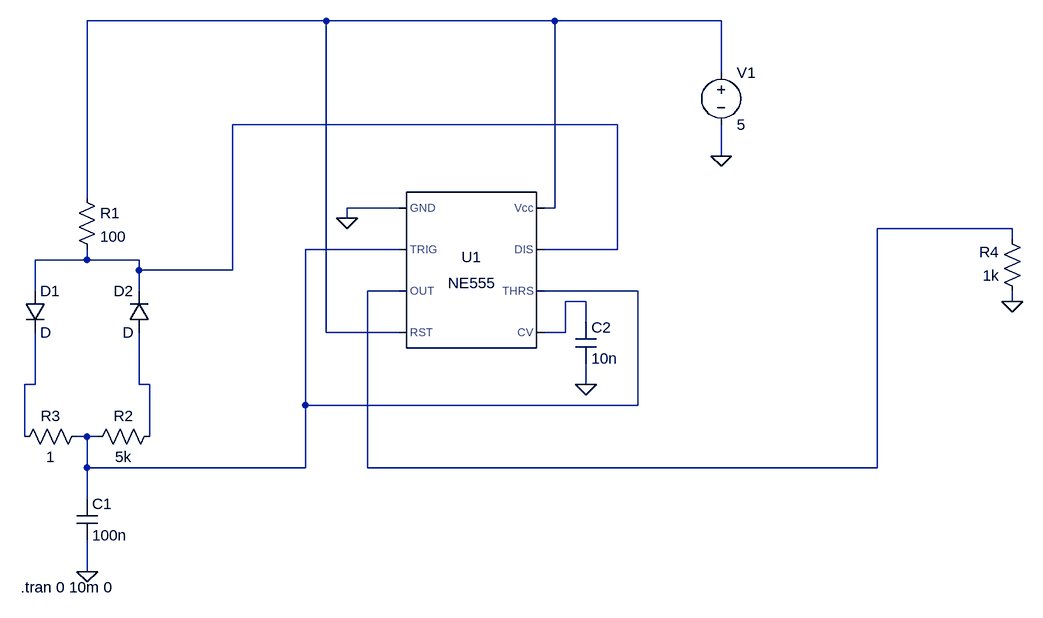
[diagram p0: schematic 555_osc.asc]
555_osc.asc, the LTspice schematic file:
Version 4
SHEET 1 1764 680
WIRE 688 -400 320 -400
WIRE 1040 -400 688 -400
WIRE 1296 -400 1040 -400
WIRE 1296 -320 1296 -400
WIRE 1136 -240 544 -240
WIRE 1296 -192 1296 -240
WIRE 320 -128 320 -400
WIRE 800 -112 720 -112
WIRE 1040 -112 1040 -400
WIRE 1040 -112 1024 -112
WIRE 720 -96 720 -112
WIRE 1744 -80 1536 -80
WIRE 1744 -64 1744 -80
WIRE 800 -48 656 -48
WIRE 1136 -48 1136 -240
WIRE 1136 -48 1024 -48
WIRE 320 -32 320 -48
WIRE 320 -32 240 -32
WIRE 400 -32 320 -32
WIRE 400 -16 400 -32
WIRE 544 -16 544 -240
WIRE 544 -16 400 -16
WIRE 240 16 240 -32
WIRE 400 16 400 -16
WIRE 800 16 752 16
WIRE 1168 16 1024 16
WIRE 1088 32 1056 32
WIRE 1744 32 1744 16
WIRE 1088 64 1088 32
WIRE 688 80 688 -400
WIRE 800 80 688 80
WIRE 1056 80 1056 32
WIRE 1056 80 1024 80
WIRE 240 160 240 80
WIRE 240 160 224 160
WIRE 400 160 400 80
WIRE 416 160 400 160
WIRE 1088 160 1088 128
WIRE 656 192 656 -48
WIRE 1168 192 1168 16
WIRE 1168 192 656 192
WIRE 224 240 224 160
WIRE 320 240 304 240
WIRE 336 240 320 240
WIRE 416 240 416 160
WIRE 320 288 320 240
WIRE 656 288 656 192
WIRE 656 288 320 288
WIRE 752 288 752 16
WIRE 1536 288 1536 -80
WIRE 1536 288 752 288
WIRE 320 336 320 288
WIRE 320 448 320 400
FLAG 1296 -192 0
FLAG 720 -96 0
FLAG 320 448 0
FLAG 1088 160 0
FLAG 1744 32 0
SYMBOL voltage 1296 -336 R0
WINDOW 123 0 0 Left 0
WINDOW 39 0 0 Left 0
SYMATTR InstName V1
SYMATTR Value 5
SYMBOL Misc\\NE555 912 -16 R0
SYMATTR InstName U1
SYMBOL res 304 -144 R0
SYMATTR InstName R1
SYMATTR Value 100
SYMBOL diode 224 16 R0
SYMATTR InstName D1
SYMBOL diode 416 80 R180
WINDOW 0 24 64 Left 2
WINDOW 3 24 0 Left 2
SYMATTR InstName D2
SYMBOL res 432 224 R90
WINDOW 0 0 56 VBottom 2
WINDOW 3 32 56 VTop 2
SYMATTR InstName R2
SYMATTR Value 5k
SYMBOL res 320 224 R90
WINDOW 0 0 56 VBottom 2
WINDOW 3 32 56 VTop 2
SYMATTR InstName R3
SYMATTR Value 1
SYMBOL cap 304 336 R0
SYMATTR InstName C1
SYMATTR Value 100n
SYMBOL cap 1072 64 R0
SYMATTR InstName C2
SYMATTR Value 10n
SYMBOL res 1760 32 R180
WINDOW 0 36 76 Left 2
WINDOW 3 36 40 Left 2
SYMATTR InstName R4
SYMATTR Value 1k
TEXT 218 472 Left 2 !.tran 0 10m 0

The netlist it stands for:
* 555_osc.asc
V1 N001 0 5
XU1 0 N004 N003 N001 N005 N004 N002 N001 NE555  ; pins GND TRIG OUT RST CV THRS DIS Vcc
R1 N001 N002 100
D1 N002 N006 D
D2 N007 N002 D
R2 N007 N004 5k
R3 N004 N006 1
C1 N004 0 100n
C2 N005 0 10n
R4 0 N003 1k
.model D D
.lib standard.dio
.tran 0 10m 0
.lib NE555.sub
.backanno
.end